# Altium schematic sheet MainRTD.SchDoc
size A4
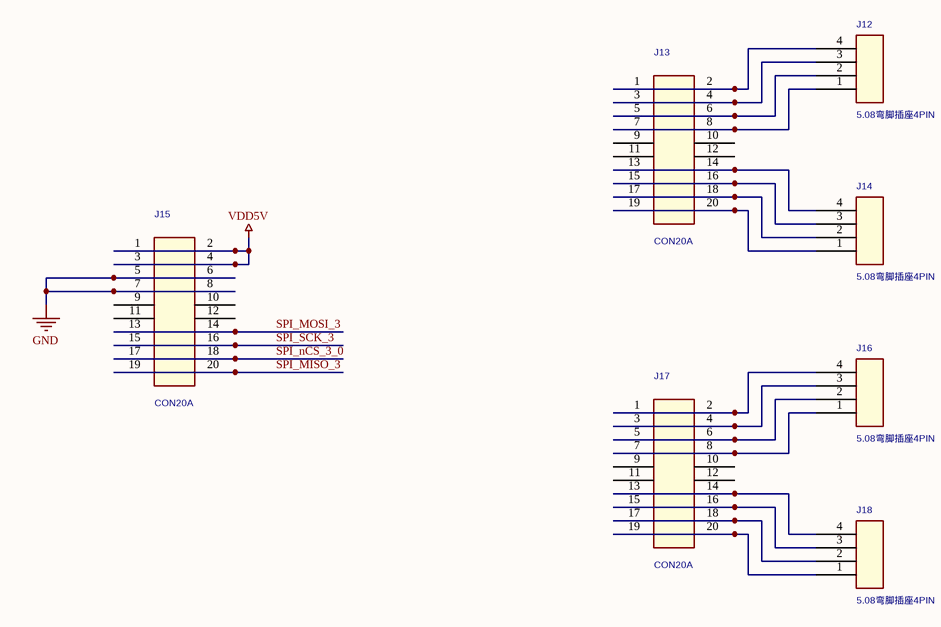
[diagram p0: MainRTD.SchDoc]

## Parts
J12  5.08弯脚插座4PIN  [JIEKE_4PX508]
J13  CON20A  [HDR2X10]
J14  5.08弯脚插座4PIN  [JIEKE_4PX508]
J15  CON20A  [HDR2X10]
J16  5.08弯脚插座4PIN  [JIEKE_4PX508]
J17  CON20A  [HDR2X10]
J18  5.08弯脚插座4PIN  [JIEKE_4PX508]

## Nets
GND: J15.5 J15.6 J15.7 J15.8
VDD5V: J15.1 J15.2 J15.3 J15.4
SPI_MISO_3: J15.19 J15.20
SPI_MOSI_3: J15.13 J15.14
SPI_nCS_3_0: J15.17 J15.18
SPI_SCK_3: J15.15 J15.16
NetJ12_1: J12.1 J13.7 J13.8
NetJ12_2: J12.2 J13.5 J13.6
NetJ12_3: J12.3 J13.3 J13.4
NetJ12_4: J12.4 J13.1 J13.2
NetJ13_13: J13.13 J13.14 J14.4
NetJ13_15: J13.15 J13.16 J14.3
NetJ13_17: J13.17 J13.18 J14.2
NetJ13_19: J13.19 J13.20 J14.1
NetJ16_1: J16.1 J17.7 J17.8
NetJ16_2: J16.2 J17.5 J17.6
NetJ16_3: J16.3 J17.3 J17.4
NetJ16_4: J16.4 J17.1 J17.2
NetJ17_13: J17.13 J17.14 J18.4
NetJ17_15: J17.15 J17.16 J18.3
NetJ17_17: J17.17 J17.18 J18.2
NetJ17_19: J17.19 J17.20 J18.1

Not connected (* = marked no-connect by the designer): J13 9 10 11 12; J15 9 10 11 12; J17 9 10 11 12

## Library data of the parts
J12 J14 J16 J18 = CON4: PCB Footprint SMD: 插件
  J12: TOLERANCE: =J68_TOLERANCE
  J14: TOLERANCE: =J69_TOLERANCE
  J16: TOLERANCE: =J72_TOLERANCE
  J18: TOLERANCE: =J73_TOLERANCE
J13 J15 J17 = CON20A: PCB Footprint SMD: 插件
  J13: TOLERANCE: =J67_TOLERANCE
  J15: TOLERANCE: =J70_TOLERANCE
  J17: TOLERANCE: =J71_TOLERANCE